# Altium schematic sheet SSFocuser-C-TMC2208.SchDoc
size A4
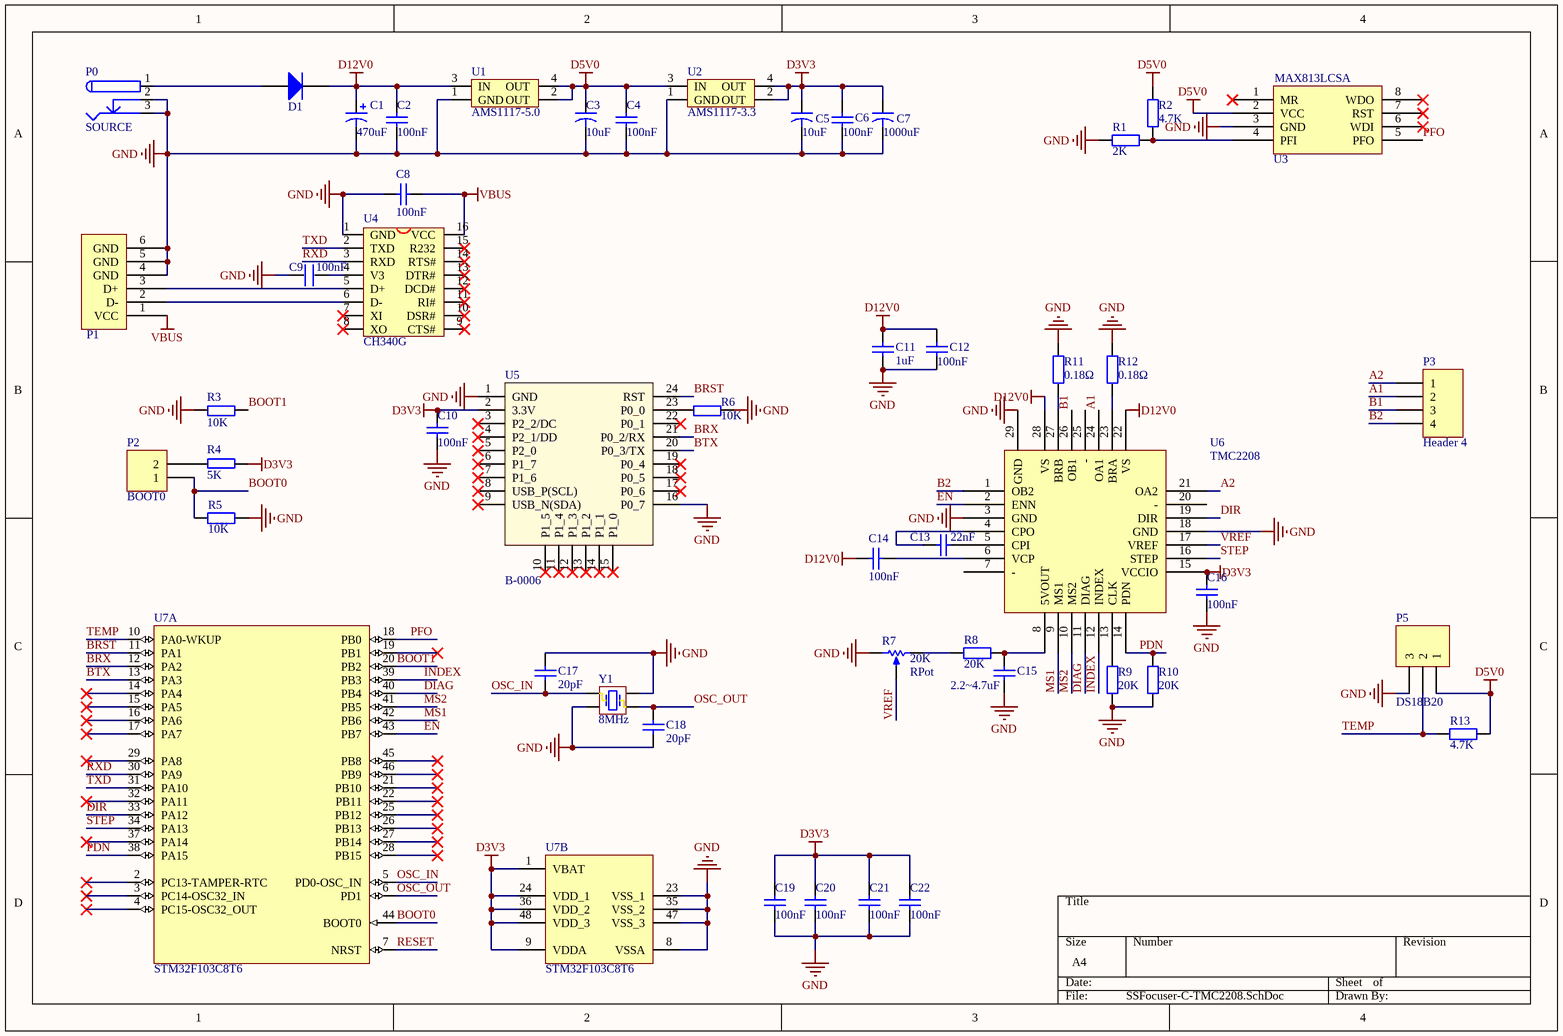
[diagram p0: SSFocuser-C-TMC2208.SchDoc]

## Parts
C1  470uF  [16V/470U(CD10X10D5)]
C2  100nF  [0603C]
C3  10uF  [3216]
C4  100nF  [0603C]
C5  10uF  [3216]
C6  100nF  [0603C]
C7  1000uF  [16V/470U(CD10X10D5)]
C8  100nF  [0603C]
C9  100nF  [0603C]
C10  100nF  [0603C]
C11  1uF  [1206C]
C12  100nF  [0603C]
C13  22nF  [0603C]
C14  100nF  [0603C]
C15  2.2~4.7uF  [0603C]
C16  100nF  [0603C]
C17  20pF  [0603C]
C18  20pF  [0603C]
C19  100nF  [0603C]
C20  100nF  [0603C]
C21  100nF  [0603C]
C22  100nF  [0603C]
D1  M7  [DO-214AC]  (value not drawn)
P0  SOURCE  [DC_5.5MM]
P1  USB-B  [USB-B]  (value not drawn)
P2  BOOT0  [HDR1X2]
P3  Header 4  [XH_4_V]
P5  DS18B20  [TO-92B]
R1  2K  [0603R]
R2  4.7K  [0603R]
R3  10K  [0603R]
R4  5K  [0603R]
R5  10K  [0603R]
R6  10K  [0603R]
R7  RPot  value 20K  [VR_SMD]
R8  20K  [0603R]
R9  20K  [0603R]
R10  20K  [0603R]
R11  0.18Ω  [1206R]
R12  0.18Ω  [1206R]
R13  4.7K  [0603R]
U1  AMS1117-5.0  [SOT223]
U2  AMS1117-3.3  [SOT223]
U3  MAX813LCSA  [SOP-8]
U4  CH340G  [SO-16]
U5  B-0006  [B-0006]
U6  TMC2208  [QFN28 5x5_M]
U7  STM32F103C8T6  [LQFP48_N]  (parts A,B of 2)
Y1  8MHz  [X3225]

## Nets
D3V3: C5.1 C6.2 C7.1 C10.2 C16.2 C19.2 C20.2 C21.2 C22.2 R4.1 U2.2(OUT) U2.4(OUT) U5.2(3.3V) U6.15(VCCIO) U7.1(VBAT) U7.9(VDDA) U7.24(VDD_1) U7.36(VDD_2) U7.48(VDD_3)
D5V0: C3.1 C4.2 P5.1 R2.2 R13.2 U1.2(OUT) U1.4(OUT) U2.3(IN) U3.2(VCC)
D12V0: C1.1 C2.2 C11.1 C12.2 C14.2 D1.2(K) U1.3(IN) U6.22(VS) U6.28(VS)
GND: C1.2 C2.1 C3.2 C4.1 C5.2 C6.1 C7.2 C8.1 C9.1 C10.1 C11.2 C12.1 C15.1 C16.1 C17.2 C18.2 C19.1 C20.1 C21.1 C22.1 P0.2 P0.3 P1.4(GND) P1.5(GND) P1.6(GND) P5.3 R1.2 R3.1 R5.2 R6.2 R7.1(TOP) R9.1 R10.1 R11.1 R12.1 U1.1(GND) U2.1(GND) U3.3(GND) U4.1(GND) U5.1(GND) U5.16(P0_7) U6.3(GND) U6.18(GND) U6.29(GND) U7.8(VSSA) U7.23(VSS_1) U7.35(VSS_2) U7.47(VSS_3) Y1.2(NA) Y1.4(NA)
VBUS: C8.2 P1.1(VCC) U4.16(VCC)
A1: P3.2 U6.24(OA1)
A2: P3.1 U6.21(OA2)
B1: P3.3 U6.26(OB1)
B2: P3.4 U6.1(OB2)
BOOT0: P2.1 R5.1 U7.44(BOOT0)
BOOT1: R3.2 U7.20(PB2)
BRST: U5.24(RST) U7.11(PA1)
BRX: U5.21(P0_2/RX) U7.12(PA2)
BTX: U5.20(P0_3/TX) U7.13(PA3)
DIAG: U6.11(DIAG) U7.40(PB4)
DIR: U6.19(DIR) U7.33(PA12)
EN: U6.2(ENN) U7.43(PB7)
INDEX: U6.12(INDEX) U7.39(PB3)
MS1: U6.9(MS1) U7.42(PB6)
MS2: U6.10(MS2) U7.41(PB5)
OSC_IN: C17.1 U7.5(PD0-OSC_IN) Y1.1(OSC1)
OSC_OUT: C18.1 U7.6(PD1) Y1.3(OSC2)
PDN: R10.2 U6.14(PDN) U7.38(PA15)
PFO: U3.5(PFO) U7.18(PB0)
RESET: U7.7(NRST)
RXD: U4.3(RXD) U7.30(PA9)
STEP: U6.16(STEP) U7.34(PA13)
TEMP: P5.2 R13.1 U7.10(PA0-WKUP)
TXD: U4.2(TXD) U7.31(PA10)
VREF: R7.3(TAP) U6.17(VREF)
NetC9_2: C9.2 U4.4(V3)
NetC13_1: C13.1 U6.5(CPI)
NetC13_2: C13.2 U6.4(CPO)
NetC14_1: C14.1 U6.6(VCP)
NetC15_2: C15.2 R8.1 U6.8(5VOUT)
NetD1_1: D1.1(A) P0.1
NetP1_2: P1.2(D-) U4.6(D-)
NetP1_3: P1.3(D+) U4.5(D+)
NetP2_2: P2.2 R4.2
NetR1_1: R1.1 R2.1 U3.4(PFI)
NetR6_1: R6.1 U5.23(P0_0)
NetR7_2: R7.2(BOT) R8.2
NetR9_2: R9.2 U6.13(CLK)
NetR11_2: R11.2 U6.27(BRB)
NetR12_2: R12.2 U6.23(BRA)

Not connected (* = marked no-connect by the designer): U3 1(MR)* 6(WDI)* 7(RST)* 8(WDO)*; U4 7(XI)* 8(XO)* 9(CTS#)* 10(DSR#)* 11(RI#)* 12(DCD#)* 13(DTR#)* 14(RTS#)* 15(R232)*; U5 3(P2_2/DC)* 4(P2_1/DD)* 5(P2_0)* 6(P1_7)* 7(P1_6)* 8(USB_P(SCL))* 9(USB_N(SDA))* 10(P1_5)* 11(P1_4)* 12(P1_3)* 13(P1_2)* 14(P1_1)* 15(P1_0)* 17(P0_6)* 18(P0_5)* 19(P0_4)* 22(P0_1)*; U6 7(-) 20(-) 25(-); U7 2(PC13-TAMPER-RTC)* 3(PC14-OSC32_IN)* 4(PC15-OSC32_OUT)* 14(PA4)* 15(PA5)* 16(PA6)* 17(PA7)* 19(PB1)* 21(PB10)* 22(PB11)* 25(PB12)* 26(PB13)* 27(PB14)* 28(PB15)* 29(PA8)* 32(PA11)* 37(PA14)* 45(PB8)* 46(PB9)*

## Library data of the parts
C1 = C470UF016S: 470UF      16V      CD10X10D5
C2 C4 C6 C8 C10-C22 = Cap: Capacitor; Published: 8-Jun-2000; LatestRevisionDate: 17-Jul-2002; LatestRevisionNote: Re-released for DXP Platform.; PackageReference: RAD-0.3; Publisher: Altium Limited
  C2 C4 C6 C8 C10 C12 C14 C16 C19-C22: Value: 100nF
  C11: Value: 1uF
  C13: Value: 22nF
  C15: Value: 2.2~4.7uF
  C17 C18: Value: 20pF
C3 C5 C7 = CAP2
  C3 C5: vaule: 10uF
  C7: vaule: 1000uF
C9 = C
D1 = Diode: High Conductance Fast Diode; pin to pad: 1>2 2>1; Published: 8-Jun-2000; LatestRevisionDate: 17-Jul-2002; LatestRevisionNote: Re-released for DXP Platform.; DatasheetDocument: 1997; PackageReference: DO-35; Publisher: Altium Limited; Code_JEDEC: DO-204-AH; ComponentLink1Description: Manufacturer Link; ComponentLink1URL: http://www.fairchildsemi.com/; ComponentLink2Description: Datasheet; ComponentLink2URL: http://www.fairchildsemi.com/ds/1N%2F1N4448.pdf
P2 = MHDR1X2: Header, 2-Pin; LatestRevisionDate: 17-Jul-2002; LatestRevisionNote: Re-released for DXP Platform.; Publisher: Altium Limited
P3 = Header 4: Header, 4-Pin; LatestRevisionDate: 17-Jul-2002; LatestRevisionNote: Re-released for DXP Platform.; Publisher: Altium Limited
P5 = Header 3: Header, 3-Pin; LatestRevisionDate: 17-Jul-2002; LatestRevisionNote: Re-released for DXP Platform.; Publisher: Altium Limited
R1 R2 R5 R8-R13 = RES: Resistor; Value: 1K; Published: 8-Jun-2000; Revision: July-2002: Re-released for DXP Platform.; Publisher: Altium Limited
R3 R4 R6 = R
R7 = RPot: Potentiometer; Sim Note: Enter the Resistance value and the set point into parameter fields.; Set Position: 0.5; Published: 8-Jun-2000; LatestRevisionDate: 17-Jul-2002; LatestRevisionNote: Re-released for DXP Platform.; PackageReference: VR5; Publisher: Altium Limited; PackageDescription: Variable Resistor, Thru-Hole; 3 Leads
U1 U2 = AMS1117
U3 = MAX813L
U4 = CH340G: USB2UART
U7 = STM32F103C8T6: STM32 ARM-based 32-bit MCU Performance Line with 64 kB Flash, 20 kB Internal RAM, -40 to +85癈 Temperature, 48-Pin LQFP, Tray; DatasheetVersion: rev13.0, Apr-2011; PackageVersion: rev13, Apr-2011; PackageReference: LQFP48; PackageDescription: 48-Pin Low-Profile Quad Flat Pack, 7 x 7 mm Body, 0.5 mm Pitch (LQFP48); ComponentLink1Description: Manufacturer URL; ComponentLink1URL: http://www.st.com/; ComponentLink2Description: STM32F103 Datasheet; ComponentLink2URL: http://www.st.com/internet/com/TECHNICAL_RESOURCES/TECHNICAL_LITERATURE/DATASHEET/CD00161566.pdf; ComponentLink3Description: STM32 Family Web Page; ComponentLink3URL: www.st.com/stm32
Y1 = XTAL_1: Crystal Oscillator; Published: 8-Jun-2000; LatestRevisionDate: 17-Jul-2002; LatestRevisionNote: Re-released for DXP Platform.; PackageReference: R38; Publisher: Altium Limited; Value: 8MHz
P0 = SOURCE: LatestRevisionDate: 17-Jul-2002; LatestRevisionNote: Re-released for DXP Platform.; Publisher: Altium Limited